# Altium schematic sheet Microcontroller.SchDoc: MCU - RC Car
size A3; DrawnBy: Grzegorz Jabłoński; Revision: V1.3; SheetNumber: 2; SheetTotal: 3
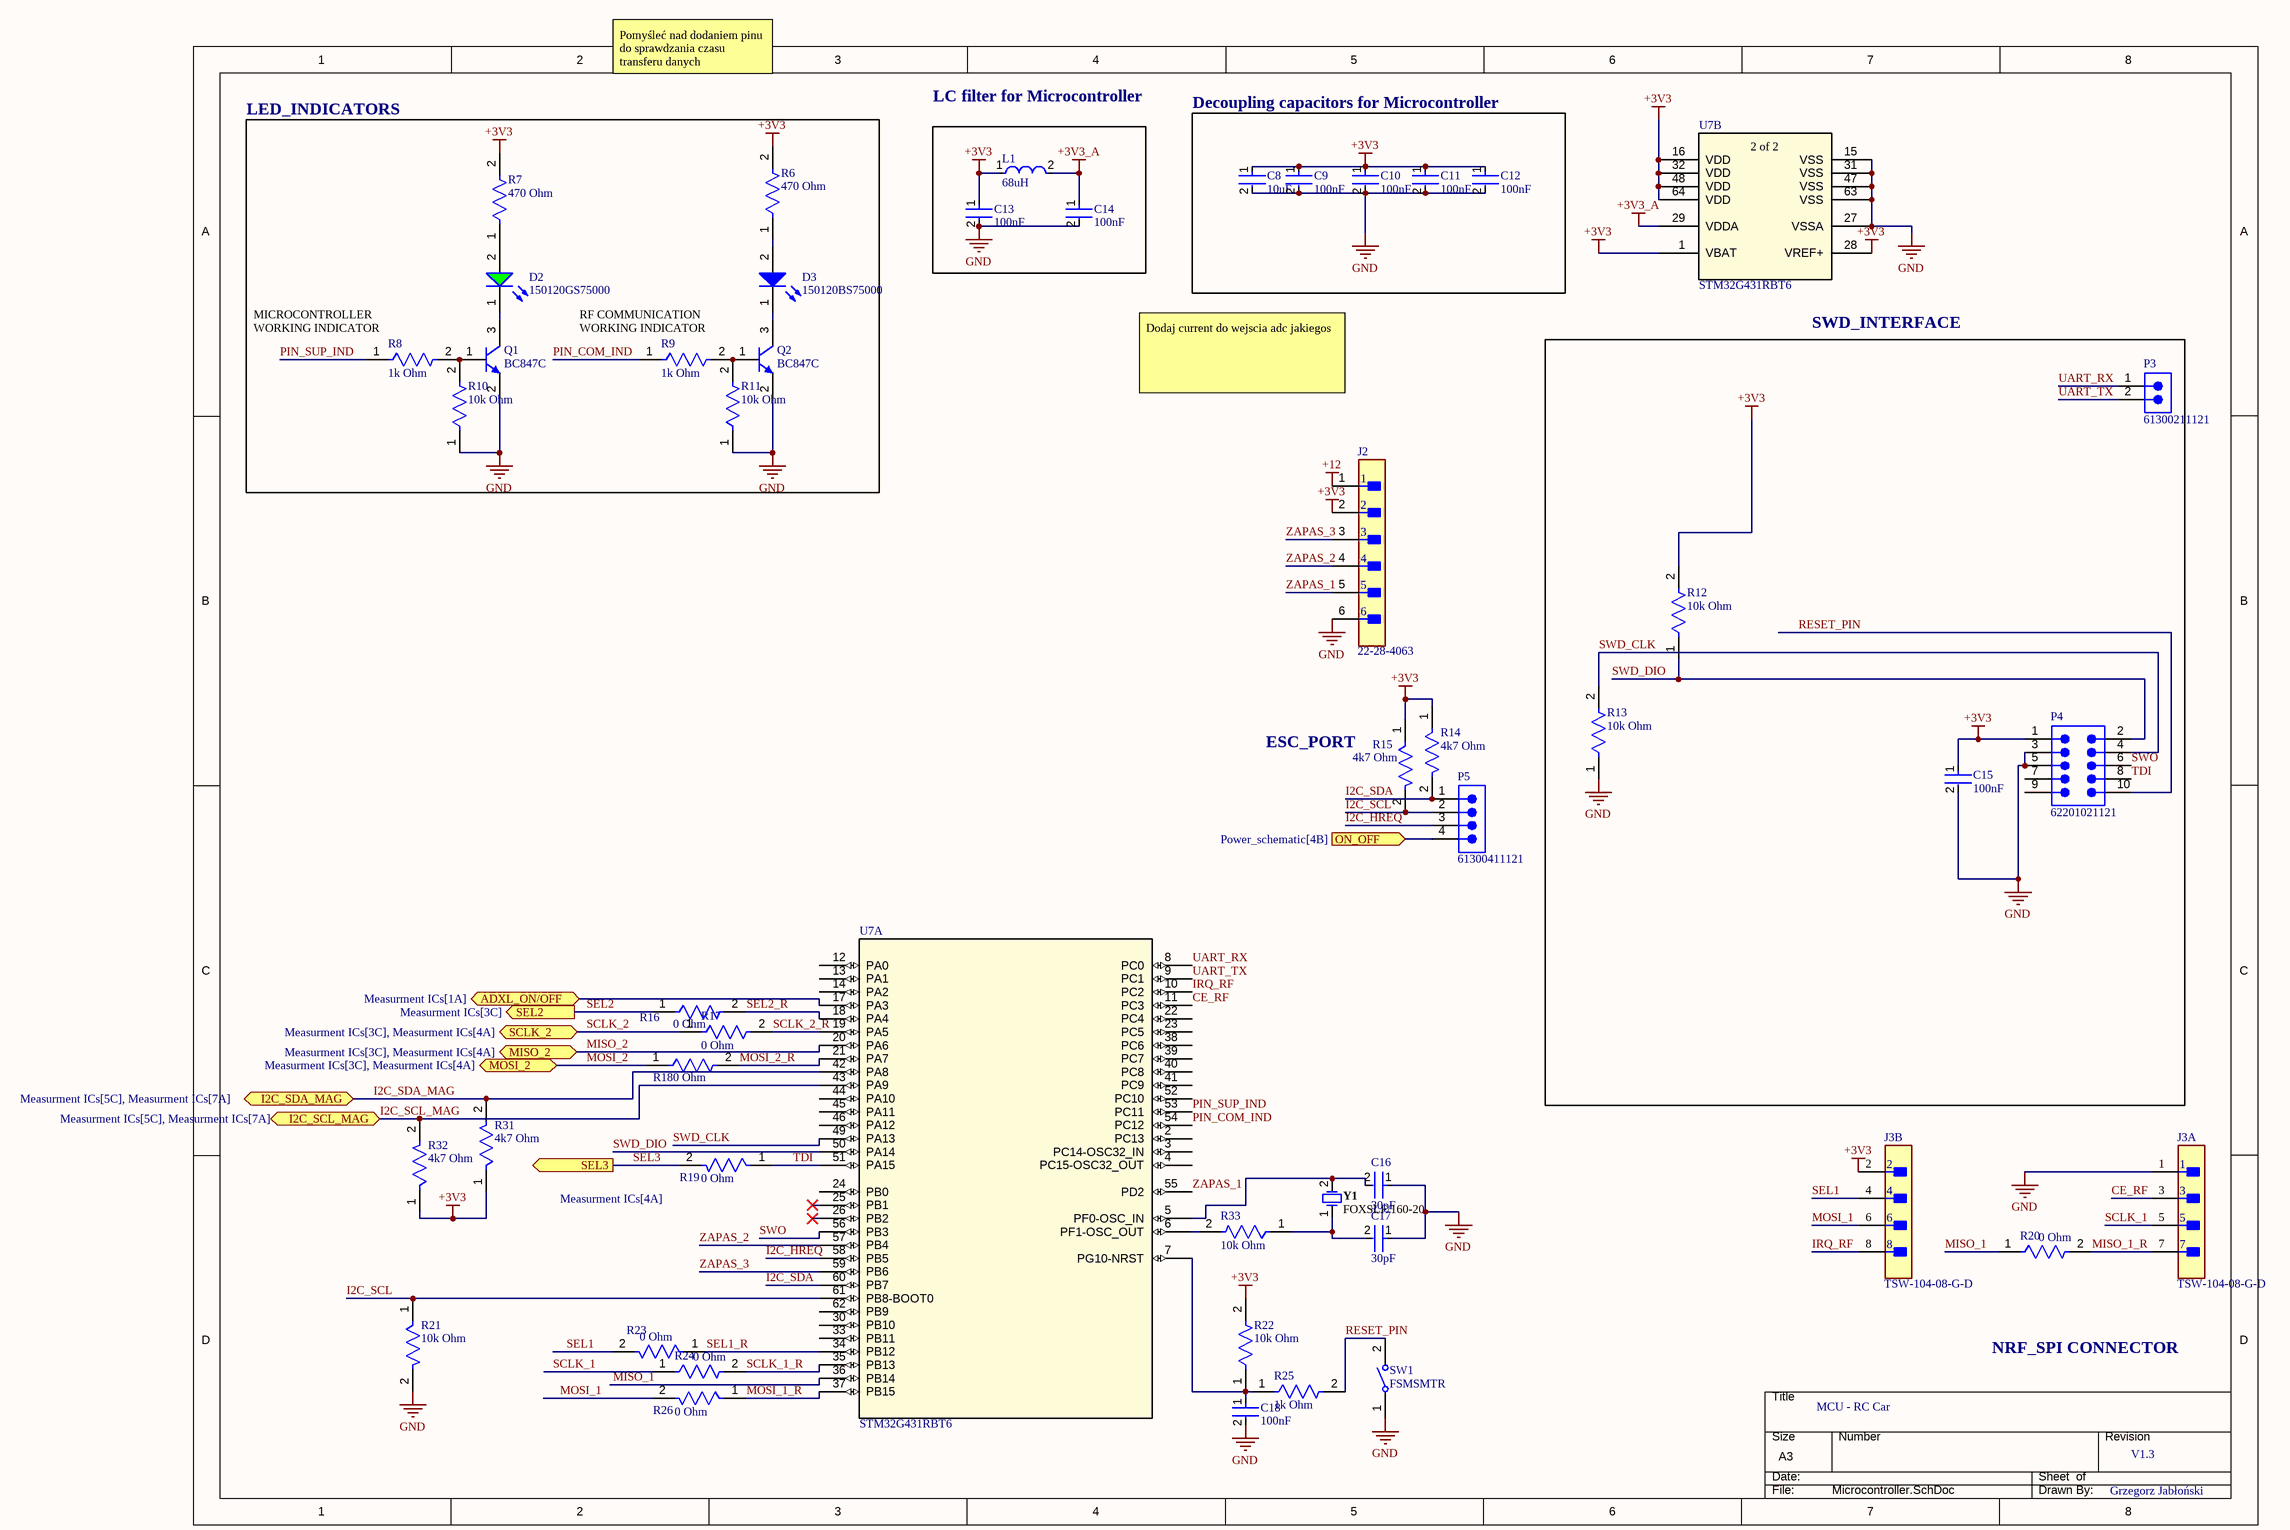
[diagram p0: Microcontroller.SchDoc]

## Parts
C8  10uF  [FP-CC0805-0_85-MFG]
C9  100nF  [FP-CC0805-0_85-MFG]
C10  100nF  [FP-CC0805-0_85-MFG]
C11  100nF  [FP-CC0805-0_85-MFG]
C12  100nF  [FP-CC0805-0_85-MFG]
C13  100nF  [FP-CC0805-0_85-MFG]
C14  100nF  [FP-CC0805-0_85-MFG]
C15  100nF  [FP-CC0805-0_85-MFG]
C16  30pF  [FP-CC0805-0_85-MFG]
C17  30pF  [FP-CC0805-0_85-MFG]
C18  100nF  [FP-CC0805-0_85-MFG]
D2  150120GS75000  [WL-SMCW_1206_150120xx75000]
D3  150120BS75000  [WL-SMCW_1206_150120xx75000]
J2  22-28-4063  [FP-22-28-4063-MFG]
J3  TSW-104-08-G-D  [FP-TSW-104-08-G-D-MFG]  (parts A,B of 2)
L1  68uH  [FP-CB2518-MFG]
P3  61300211121  [61300211121]
P4  62201021121  [62201021121]
P5  61300411121  [61300411121]
Q1  BC847C  [INF-SOT23_L]
Q2  BC847C  [INF-SOT23_L]
R6  470 Ohm  [FP-RMCF0805-MFG]
R7  470 Ohm  [FP-RMCF0805-MFG]
R8  1k Ohm  [FP-RMCF0805-MFG]
R9  1k Ohm  [FP-RMCF0805-MFG]
R10  10k Ohm  [FP-RMCF0805-MFG]
R11  10k Ohm  [FP-RMCF0805-MFG]
R12  10k Ohm  [FP-RMCF0805-MFG]
R13  10k Ohm  [FP-RMCF0805-MFG]
R14  4k7 Ohm  [FP-RMCF0805-MFG]
R15  4k7 Ohm  [FP-RMCF0805-MFG]
R16  0 Ohm  [FP-RMCF0805-MFG]
R17  0 Ohm  [FP-RMCF0805-MFG]
R18  0 Ohm  [FP-RMCF0805-MFG]
R19  0 Ohm  [FP-RMCF0805-MFG]
R20  0 Ohm  [FP-RMCF0805-MFG]
R21  10k Ohm  [FP-RMCF0805-MFG]
R22  10k Ohm  [FP-RMCF0805-MFG]
R23  0 Ohm  [FP-RMCF0805-MFG]
R24  0 Ohm  [FP-RMCF0805-MFG]
R25  1k Ohm  [FP-RMCF0805-MFG]
R26  0 Ohm  [FP-RMCF0805-MFG]
R31  4k7 Ohm  [FP-RMCF0805-MFG]
R32  4k7 Ohm  [FP-RMCF0805-MFG]
R33  10k Ohm  [FP-RMCF0805-MFG]
SW1  FSMSMTR  [TECO-FSMSMTR_V]
U7  STM32G431RBT6  [LQFP64-10x10mm]  (parts A,B of 2)
Y1  FOXSLF/160-20  [FOX-FOXSLF160-20]

## Blocks framed on the sheet
LED_INDICATORS: D2 D3 Q1 Q2 R6-R11
Decoupling capacitors for Microcontroller: C8-C12
SWD_INTERFACE: C15 P3 P4 R12 R13

## Ports
ADXL_ON/OFF (bidir, see Measurment ICs[1A]), I2C_SCL_MAG (bidir, see Measurment ICs[5C], Measurment ICs[7A]), I2C_SDA_MAG (bidir, see Measurment ICs[5C], Measurment ICs[7A]), MISO_2 (bidir, see Measurment ICs[3C], Measurment ICs[4A]), MOSI_2 (bidir, see Measurment ICs[3C], Measurment ICs[4A]), ON_OFF (in, see Power_schematic[4B]), SCLK_2 (bidir, see Measurment ICs[3C], Measurment ICs[4A]), SEL2 (out, see Measurment ICs[3C]), SEL3 (out, see Measurment ICs[4A])

## Nets
+3V3: C8.1 C9.1 C10.1 C11.1 C12.1 C13.1 C15.1 J2.2 J3.2 L1.1 P4.1 R6.2 R7.2 R12.2 R14.1 R15.1 R22.2 R31.1 R32.1 U7.1(VBAT) U7.16(VDD) U7.28(VREF+) U7.32(VDD) U7.48(VDD) U7.64(VDD)
+3V3_A: C14.1 L1.2 U7.29(VDDA)
+12: J2.1
GND: C8.2 C9.2 C10.2 C11.2 C12.2 C13.2 C14.2 C15.2 C16.1 C17.1 C18.2 J2.6 J3.1 P4.3 P4.5 Q1.2(E) Q2.2(E) R10.1 R11.1 R13.1 R21.2 SW1.1 U7.15(VSS) U7.27(VSSA) U7.31(VSS) U7.47(VSS) U7.63(VSS)
ADXL_ON/OFF: U7.17(PA3) ; port ADXL_ON/OFF
CE_RF: J3.3 U7.11(PC3)
I2C_HREQ: P5.3 U7.58(PB5)
I2C_SCL: P5.2 R15.2 R21.1 U7.61(PB8-BOOT0)
I2C_SCL_MAG: R32.2 U7.43(PA9) ; port I2C_SCL_MAG
I2C_SDA: P5.1 R14.2 U7.60(PB7)
I2C_SDA_MAG: R31.2 U7.42(PA8) ; port I2C_SDA_MAG
IRQ_RF: J3.8 U7.10(PC2)
MISO_1: R20.1 U7.36(PB14)
MISO_1_R: J3.7 R20.2
MISO_2: U7.20(PA6) ; port MISO_2
MOSI_1: J3.6 R26.2
MOSI_1_R: R26.1 U7.37(PB15)
MOSI_2: R18.1 ; port MOSI_2
MOSI_2_R: R18.2 U7.21(PA7)
ON_OFF: P5.4 ; port ON_OFF
PIN_COM_IND: R9.1 U7.54(PC12)
PIN_SUP_IND: R8.1 U7.53(PC11)
RESET_PIN: P4.10 R25.2 SW1.2
SCLK_1: J3.5 R24.1
SCLK_1_R: R24.2 U7.35(PB13)
SCLK_2: R17.1 ; port SCLK_2
SCLK_2_R: R17.2 U7.19(PA5)
SEL1: J3.4 R23.2
SEL1_R: R23.1 U7.34(PB12)
SEL2: R16.1 ; port SEL2
SEL2_R: R16.2 U7.18(PA4)
SEL3: R19.2 ; port SEL3
SWD_CLK: P4.4 R13.2 U7.49(PA13)
SWD_DIO: P4.2 R12.1 U7.50(PA14)
SWO: P4.6 U7.56(PB3)
TDI: P4.8 R19.1 U7.51(PA15)
UART_RX: P3.1 U7.8(PC0)
UART_TX: P3.2 U7.9(PC1)
ZAPAS_1: J2.5 U7.55(PD2)
ZAPAS_2: J2.4 U7.57(PB4)
ZAPAS_3: J2.3 U7.59(PB6)
NetC16_2: C16.2 U7.5(PF0-OSC_IN) Y1.2
NetC17_2: C17.2 R33.1 Y1.1
NetC18_1: C18.1 R22.1 R25.1 U7.7(PG10-NRST)
NetD2_1: D2.1(K) Q1.3(C)
NetD2_2: D2.2(A) R7.1
NetD3_1: D3.1(K) Q2.3(C)
NetD3_2: D3.2(A) R6.1
NetQ1_1: Q1.1(B) R8.2 R10.2
NetQ2_1: Q2.1(B) R9.2 R11.2
NetR33_2: R33.2 U7.6(PF1-OSC_OUT)

Not connected (* = marked no-connect by the designer): P4 7 9; U7 2(PC13) 3(PC14-OSC32_IN) 4(PC15-OSC32_OUT) 12(PA0) 13(PA1) 14(PA2) 22(PC4) 23(PC5) 24(PB0) 25(PB1)* 26(PB2)* 30(PB10) 33(PB11) 38(PC6) 39(PC7) 40(PC8) 41(PC9) 44(PA10) 45(PA11) 46(PA12) 52(PC10) 62(PB9)

## Notes on the sheet
- Pomyśleć nad dodaniem pinu do sprawdzania czasu transferu danych
- LC filter for Microcontroller
- (near R8) MICROCONTROLLER WORKING INDICATOR
- (near R9) RF COMMUNICATION WORKING INDICATOR
- Dodaj current do wejscia adc jakiegos
- ESC_PORT
- NRF_SPI CONNECTOR
- THIS DOCUMENT AND THE DATA DISCLOSED HEREIN OR
- HEREWITH IS THE PROPERTY OF ALTIUM LIMITED AND MAY
- DWG NO:
- REVISION
- REV:
- DESCRIPTION
- DATE
- APPROVED
- BE FREELY DISTRIBUTED IN WHOLE. NO RIGHTS ARE
- RESERVED OR EXPRESS OR IMPLIED WARANTEE GIVEN.
- ENG:
- APPROVALS
- PROJECT
- DSN:
- CHK:
- REFERENCE DOCUMENTS
- PROJECT REVISION:
- TITLE
- DOCUMENT REVISION:
- DESIGN ITEM:
- BOM:
- FAB DWG:
- PCB DWG:
- ASSY DWG:
- SCALE:
- A3
- SIZE
- CAGE CODE
- FILE NAME
- DWG NO.
- SHEET
- OF
- REV
- (in symbol STM32G431RBT6, part B) 2 of 2

## Library data of the parts
C8 C16 C17 = CMP-2100-03606-3: CAP CER 0.1UF 50V X7R 0805; Manufacturer Part Number: CC0805KRX7R9BB104; Manufacturer: Yageo; Tolerance: 0.1; Capacitance: 100 nF; Value: 100 nF; Material: Ceramic; Device Class L1: Passive Components; ComponentLink2Description: Datasheet; Package: CC0805-0.85; Digikey Description: CAP CER 0.1UF 50V X7R 0805; Device Class L3: Ceramic Capacitors; Temperature: -30°C to +85°C; Temperature Characteristic: X7R; Voltage Rating: 50 V; Height: 0.95mm; RoHS: TRUE; Ipc Land Pattern Name: CAPC200125X85; Device Class L2: Capacitors; Category: Cap; Temperature Range Low: -30°C; Temperature Range High: +85°C; Mouser Description: Multilayer Ceramic Capacitors MLCC - SMD/SMT 100nF 50V X7R 10%; Footprint Url: http://www.yageo.com/exep/pages/download/literatures/UPY-C_GEN_24.pdf; Automotive: No; Octopart: https://octopart.com/cc0805krx7r9bb104-yageo-192993; Lead Free: Yes; ComponentLink2URL: http://www.yageo.com/documents/recent/UPY-GPHC_Y5V_6.3V-to-50V_8.pdf
C9-C15 C18 = CMP-2100-03606-3: CAP CER 0.1UF 50V X7R 0805; Manufacturer Part Number: CC0805KRX7R9BB104; Manufacturer: Yageo; Tolerance: 0.1; Material: Ceramic; Device Class L1: Passive Components; ComponentLink2Description: Datasheet; Package: CC0805-0.85; Digikey Description: CAP CER 0.1UF 50V X7R 0805; Capacitance: 100 nF; Device Class L3: Ceramic Capacitors; Value: 100 nF; Temperature: -30°C to +85°C; Temperature Characteristic: X7R; Voltage Rating: 50 V; Height: 0.95mm; RoHS: TRUE; Ipc Land Pattern Name: CAPC200125X85; Device Class L2: Capacitors; Category: Cap; Temperature Range Low: -30°C; Temperature Range High: +85°C; Mouser Description: Multilayer Ceramic Capacitors MLCC - SMD/SMT 100nF 50V X7R 10%; Footprint Url: http://www.yageo.com/exep/pages/download/literatures/UPY-C_GEN_24.pdf; Automotive: No; Octopart: https://octopart.com/cc0805krx7r9bb104-yageo-192993; Lead Free: Yes; ComponentLink2URL: http://www.yageo.com/documents/recent/UPY-GPHC_Y5V_6.3V-to-50V_8.pdf
D2 = CMP-1426-00014-4: WL-SMCW SMT Mono-Color Chip LED Waterclear; Dominant Wavelength: 525nm; Reverse Voltage: 5V; Max Junction Temperature (Tj): 95°C; Lens Style: Clear, Rectangular; Forward Voltage: 3.2V; Power Dissipation: 105mW; Peak Wavelength: 515nm; Test Current: 20mA; Color: Green; Forward Current: 100mA; Luminous Intensity: 450mcd; Viewing Angle: 140°; Case Code (Imperial): 1206; REACH SVHC: Unknown; Packaging: Tape and Reel; Max Operating Temperature: 85°C; Case/Package: 1206; Height: 680µm; Length: 3.2mm; Mount: Surface Mount; Min Operating Temperature: -40°C; Width: 1.6mm; Case Code (Metric): 3216; Max Reverse Voltage (DC): 5V; RoHS: Compliant; Wavelength: 525nm
D3 = CMP-1426-00015-3: WL-SMCW SMT Mono-Color Chip LED Waterclear; Manufacturer Package Identifier: LED_1206; Dominant Wavelength: 470nm; Lens Style: Clear, Rectangular; Test Current: 20mA; Forward Voltage: 3.2V; Forward Current: 100mA; Peak Wavelength: 465nm; Max Reverse Voltage (DC): 5V; Viewing Angle: 140°; Color: Blue; Luminous Intensity: 145mcd; Max Operating Temperature: 85°C; Case Code (Imperial): 1206; Length: 3.2mm; Width: 1.6mm; Min Operating Temperature: -40°C; Height: 680µm; Case Code (Metric): 3216; Packaging: Tape and Reel; RoHS: Compliant; Case/Package: 1206; REACH SVHC: Unknown; Wavelength: 470nm; Mount: Surface Mount
J2 = CMP-04776-000885-1: CONN HEADER VERT 6POS 2.54MM; Number of Circuits: 6; Voltage Rating (DC): 250V; Connector Type: Male Pin; Contact Resistance: 20mR; Glow Wire Compliant: Non-compliant; Gender: Male; Current Rating: 4A; Max Voltage Rating (DC): 250.25kV; Series: KK® 42375; Termination: Solder; Orientation: Straight; Max Operating Temperature: 75°C; Min Operating Temperature: 0°C; Mount: Through Hole; Depth: 2.49mm; Contact Material: Brass; Number of Positions: 6; Contact Mating Length: 0.24inch; Number of Rows: 1; Housing Color: Black; Max Voltage Rating (AC): 250V; Housing Material: Thermoplastic; Packaging: Bulk; Contact Plating: Gold; Contact Type: Male Pin; Package Quantity: 1; Number of Contacts: 6; Voltage Rating: 250V; Lead Free: Lead Free; RoHS Compliant: Yes; Pitch: 2.54mm; Color: Black; Flammability Rating: UL94 V-0; Radiation Hardening: No
J3 = CMP-00575-00272549-1: TSW-104-08-G-D TSW - Samtec 2.54mm Pin Header 13.46mm Overall Pin Length 5.08mm Tail (08) (mcv)(TO22); NexarPartId: 272549; Manufacturer Lifecycle Status: PRODUCTION; Connector Type: Male Pin; Max Voltage Rating (AC): 550V; Gender: Male; Number of Contacts: 8; Max Current Rating: 7.6A; Number of Rows: 2; Packaging: Bulk; Housing Material: Polyester; Contact Plating: Gold; REACH SVHC: No SVHC; Width: 5.08mm; Row Spacing: 2.54mm; Contact Mating Length: 5.842mm; Termination: Solder; Contact Material: Bronze; Lead Pitch: 2.54mm; Min Operating Temperature: -55°C; Orientation: Straight; Lifecycle Status: Production; Color: Black; Number of Positions: 8; Max Operating Temperature: 125°C; Depth: 5.08mm; RoHS: Compliant; Housing Color: Black; Mount: Through Hole; Radiation Hardening: No; Lead Free: Lead Free; Pitch: 2.54mm; Length: 10.16mm
L1 = CMP-14484-000100-1: SMD Inductors 68uH ±10% 0.31A 1.95Ω 1007; Test Frequency: 2.52MHz; Max DC Current: 310mA; Saturation Current: 70mA; DC Resistance (DCR): 1.95R; Core Material: Ferrite; Self Resonant Frequency: 9.5MHz; Shielding: Unshielded; Inductance: 68uH; Case Code (Imperial): 1007; RoHS Compliant: Yes; Mount: Surface Mount; Package Quantity: 2000; Case/Package: 1007; Packaging: Tape and Reel; Length: 0.098inch; Resistor Type: Wirewound; Height: 1.8mm; Termination: SMD/SMT; Current Rating: 310mA; Tolerance: 10%; Height - Seated (Max): 0.079inch; Min Operating Temperature: -40°C; Depth: 2mm; Inductance Tolerance: 10%; Max Operating Temperature: 105°C; Width: 0.071inch; Halogen Free: Halogen Free; Case Code (Metric): 2518; Series: CB; Radiation Hardening: No
P3 = CMP-1712-00002-6: NexarPartId: 20081794; Number of Contacts: 2; Pitch: 2.54mm; Connector Type: Male Pin; Voltage Rating: 250V; Current Rating: 3A; Gender: Male; Contact Resistance: 20mΩ; Height: 8.94mm; Lead Free: Lead Free; Number of Pins: 2; Termination: Through Hole; RoHS: Compliant; Lead Pitch: 2.54mm; REACH SVHC: No SVHC; Housing Material: PBT; Contact Mating Length: 5.9944mm; Min Operating Temperature: -40°C; Orientation: Vertical; Contact Material: Copper; Contact Gender: Male; Max Operating Temperature: 125°C; Number of Rows: 1; Number of Positions: 2; Packaging: Bulk; Contact Plating: Gold; Mount: Through Hole; Color: Black; Operating Supply Voltage: 250V
P4 = CMP-1502-00948-3: NexarPartId: 32855586; Pitch: 1.27mm; Operating Supply Voltage: 100V; Connector Type: Male Pin; Contact Resistance: 20mΩ; Current Rating: 1A; Number of Contacts: 10; Gender: Male; Contact Mating Length: 3.81mm; Max Operating Temperature: 105°C; Mount: Through Hole; Number of Pins: 10; Row Spacing: 1.27mm; Lead Pitch: 1.27mm; REACH SVHC: Unknown; Min Operating Temperature: -40°C; Contact Material: Copper; Orientation: Vertical; Contact Plating: Gold; Number of Rows: 2; RoHS: Compliant; Packaging: Box; Voltage Rating: 100V; Color: Black; Height: 5.65mm; Termination: Solder; Number of Positions: 10
P5 = CMP-1502-01064-3: NexarPartId: 32855522; Operating Supply Voltage: 250V; Pitch: 2.54mm; Contact Resistance: 20mΩ; Number of Positions: 4; Current Rating: 3A; Connector Type: Male Pin; Gender: Male; Contact Plating: Gold; Height: 8.89mm; Lead Pitch: 2.54mm; Lead Free: Lead Free; Contact Mating Length: 5.9944mm; Number of Rows: 1; Termination: Solder; Packaging: Bulk; REACH SVHC: Unknown; Min Operating Temperature: -40°C; RoHS: Compliant; Number of Contacts: 4; Voltage Rating: 250V; Color: Black; Max Operating Temperature: 105°C; Contact Material: Copper; Mount: Through Hole; Orientation: Vertical; Number of Pins: 4
Q1 Q2 = CMP-1177-00037-1: NPN Silicon AF Transistor, 45 V VCEO, 100 mA IC, SOT23, Reel, Green; Manufacturer: Infineon; VCEO (max): 45Â V; VEBO (max): 6Â V; fT (typ): 250Â MHz; VCBO (max): 50Â V; ICM (max): 200Â mA; Green: TRUE; IC (max): 100Â mA; Ptot (max): 330Â mW; ICBO (max): 15Â nA; PartNumber: BC847C; ComponentLink3URL: http://www.infineon.com/dgdl/SOT23-Package_Overview.pdf?folderId=db3a30431936bc4b0119532290053c66&fileId=db3a30431936bc4b0119533468123c85; ComponentLink3Description: Package Specification; Mounting Technology: Surface Mount; PackageDescription: 3-Pin Small Outline Transistor Package, 1.3 x 2.9 mm Body, 0.95 mm Pitch; PackageReference: SOT23; ComponentLink2URL: http://www.infineon.com/dgdl/bc847series_bc848series_bc849series_bc850series.pdf?folderId=db3a304314dca389011541d30fa21656&fileId=db3a304314dca389011541d4630a1657; ComponentLink2Description: Datasheet; ComponentLink1Description: Manufacturer URL; Polarity: NPN; ComponentLink1URL: http://www.infineon.com/; IBM (max): 200Â mA; Packing: Reel; PackageVersion: Apr-08
R6-R26 R31-R33 = CMP-26527-000017-1: RES 0 OHM JUMPER 1/8W 0805; Power Rating: 125mW; Resistance: 0mR; Depth: 1.25mm; Length: 2mm; Military Standard: Not; Width: 0.049inch; Case Code (Imperial): 0805; Number of Terminations: 2; Mount: Surface Mount; Contact Plating: Tin; Height: 0.026inch; Case/Package: 0805; Min Operating Temperature: -55°C; Composition: Thick Film; Max Operating Temperature: 155°C; Packaging: Tape and Reel; Features: Automotive AEC-Q200; Max Power Dissipation: 125mW; Radiation Hardening: No; Lead Free: Lead Free; Case Code (Metric): 2012
SW1 = CMP-2000-07501-1: FSMSM Push Button Switch, 50 mA, -35 to 85 degC, 2-Pin SMD, RoHS, Tape and Reel; Manufacturer: TE Connectivity; Voltage Rating (DC): 24V; Electrical Life: 20000Cycles; Operating Force: 180gf; Switch Travel: 0.25mm; Contact Current Rating: 50mA; Case\/Package: SMD/SMT; Actuator Length: 1.07mm; Throw Configuration: SPST; Actuator Material: Polyamide; Contact Resistance: 100mOhm; Illumination Type: Illuminated; Max Voltage Rating (DC): 12V; Manufacturer URL: http://www.te.com/; Lead Free: LeadFree; Packaging: TapeandReel; Min Operating Temperature: -35degC; Mechanical Life: 20000Cycles; Mount: SurfaceMount; REACH SVHC: Unknown; Package Quantity: 1800; Package Reference: FSMSMTR; RoHSCompliant: true; Max Operating Temperature: 85degC; Orientation: Straight; ELV: Compliant; Datasheet URL: http://www.te.com/commerce/DocumentDelivery/DDEController?Action=showdoc&DocId=Customer+Drawing%7F1437566-3%7FC2%7Fpdf%7FEnglish%7FENG_CD_1437566-3_C2_1437566_3_1_c.dwg.pdf%7F1437566-4; Package Description: 2-Pin Surface Mount Device, Body 6 x 3.5 mm, Pitch 9.19 mm; Current Rating: 50mA; Contact Plating: Silver; Termination: GullWing; Datasheet Version: Rev. C2, 08/2014; Contact Material: Brass; Mounting Technology: SurfaceMount
U7 = STM32G431RBT6: No Description Available; Mfr_Name: STMicroelectronics; RefDes: RefDes; Type: Type
Y1 = CMP-1749-00003-1: Resistance Weld Thru-Hole Crystal, 16 MHz, -20 to 70 degC, 2-Pin THD, RoHS, Bulk; Voltage Rating: 250 V; Tolerance: 1%; Resistance: 221 kohm; Case\Package: Axial; Power Rating: 250 mW; RoHSCompliant: true; Package Quantity: 200; Packaging: Bulk; Min Operating Temperature: -55 degC; DatasheetVersion: Mar-15; ComponentLink1URL: http://www.foxonline.com/; Max Operating Temperature: 155 degC; PackageReference: FOXSLF160-20; Mount: Through Hole; PackageDescription: 2-Pin Through Hole Device, Body 11.35 x 4.65 mm; ComponentLink1Description: Manufacturer URL; ComponentLink2URL: http://www.foxonline.com/pdfs/hc49slf.pdf; ComponentLink2Description: Datasheet; Length: 0.248 inch